# EAGLE design diagnostic-main (EAGLE 9.5.0)

## Sheet 1 of 3: MCU
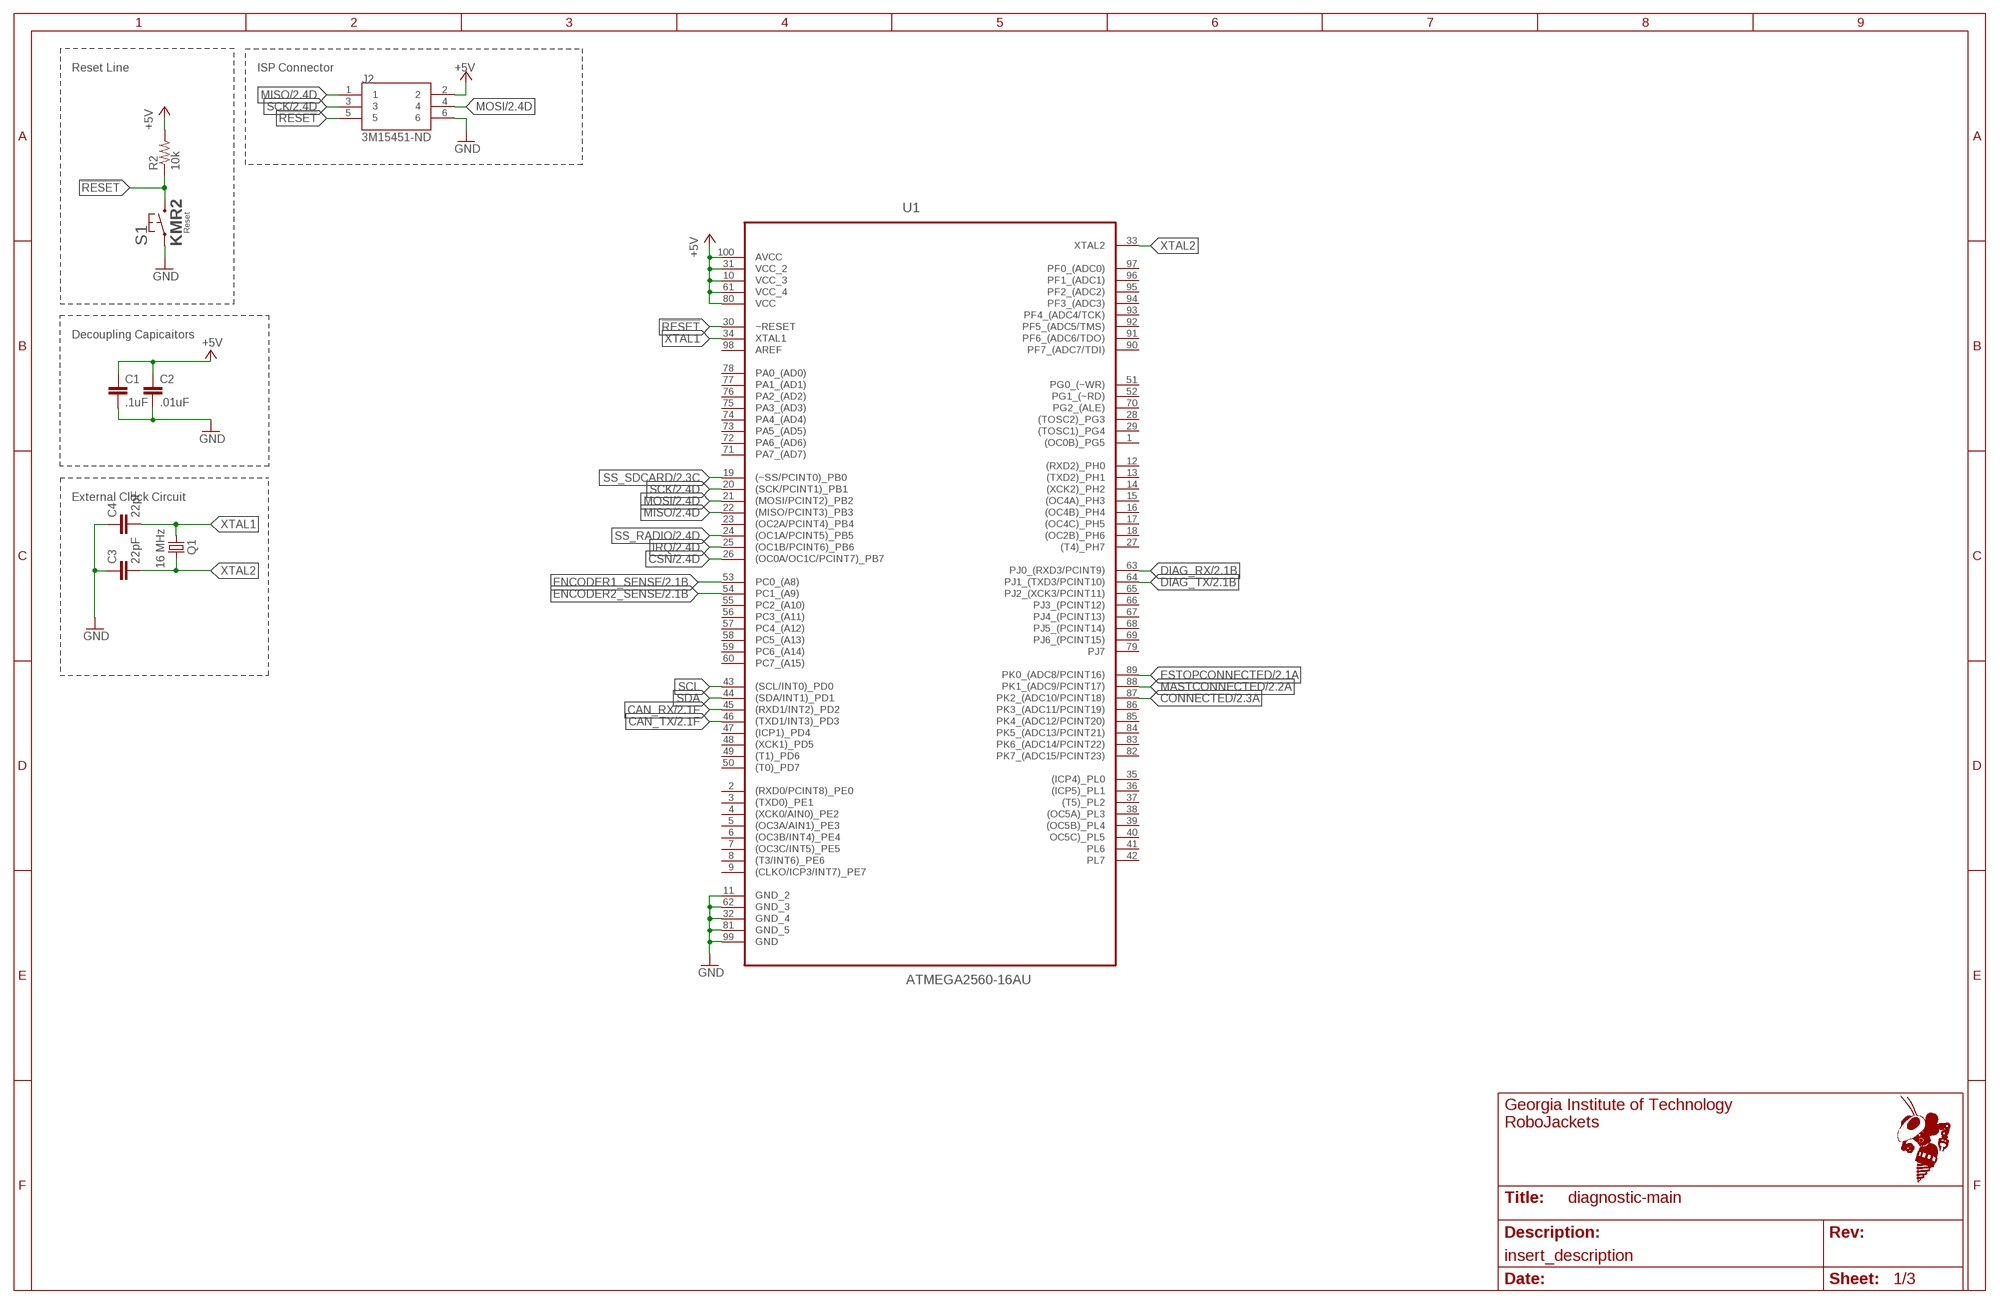
[diagram p0: schematic, sheet 1]
FRAME1 (FRAME_B_L): SCH_DESC: insert_description

### Parts
C1  .1uF  C-EUC0603  [C0603]
C2  .01uF  C-EUC0603  [C0603]
C3  22pF  C-EUC0603  [C0603]
C4  22pF  C-EUC0603  [C0603]
J2  3M15451-ND  30306-6002HB  [3M_30306-6002HB]
Q1  16 MHz  CSM-7X-DU  [CSM-7X-DU]
R2  10k  R-US_R0402  [R0402]
S1  KMR2  [KMR2]
U1  ATMEGA2560-16AU  [QFP50P1600X1600X120-100N]

### Nets
!RESET: J2.5 R2.1 S1.2.1 S1.2.2 U1.30(~RESET)
+5V: C1.1 C2.1 J2.2 R2.2 U1.10(VCC_3) U1.31(VCC_2) U1.61(VCC_4) U1.80(VCC) U1.100(AVCC) ; also sheet 2
CAN_RX: U1.45((RXD1/INT2)_PD2) ; also sheet 2
CAN_TX: U1.46((TXD1/INT3)_PD3) ; also sheet 2
CONNECTED: U1.87(PK2_(ADC10/PCINT18)) ; also sheet 2
CSN: U1.26((OC0A/OC1C/PCINT7)_PB7) ; also sheet 2
DIAG_RX: U1.63(PJ0_(RXD3/PCINT9)) ; also sheet 2
DIAG_TX: U1.64(PJ1_(TXD3/PCINT10)) ; also sheet 2
ENCODER1_SENSE: U1.53(PC0_(A8)) ; also sheet 2
ENCODER2_SENSE: U1.54(PC1_(A9)) ; also sheet 2
ESTOPCONNECTED: U1.89(PK0_(ADC8/PCINT16)) ; also sheet 2
GND: C1.2 C2.2 C3.1 C4.1 J2.6 S1.1.1 S1.1.2 U1.11(GND_2) U1.32(GND_4) U1.62(GND_3) U1.81(GND_5) U1.99(GND) ; also sheet 2
IRQ: U1.25((OC1B/PCINT6)_PB6) ; also sheet 2
MASTCONNECTED: U1.88(PK1_(ADC9/PCINT17)) ; also sheet 2
MISO: J2.1 U1.22((MISO/PCINT3)_PB3) ; also sheet 2
MOSI: J2.4 U1.21((MOSI/PCINT2)_PB2) ; also sheet 2
SCK: J2.3 U1.20((SCK/PCINT1)_PB1) ; also sheet 2
SCL: U1.43((SCL/INT0)_PD0)
SDA: U1.44((SDA/INT1)_PD1)
SS_RADIO: U1.24((OC1A/PCINT5)_PB5) ; also sheet 2
SS_SDCARD: U1.19((~SS/PCINT0)_PB0) ; also sheet 2
XTAL1: C4.2 Q1.1 U1.34(XTAL1)
XTAL2: C3.2 Q1.2 U1.33(XTAL2)
Unconnected: U1.1((OC0B)_PG5) U1.2((RXD0/PCINT8)_PE0) U1.3((TXD0)_PE1) U1.4((XCK0/AIN0)_PE2) U1.5((OC3A/AIN1)_PE3) U1.6((OC3B/INT4)_PE4) U1.7((OC3C/INT5)_PE5) U1.8((T3/INT6)_PE6) U1.9((CLKO/ICP3/INT7)_PE7) U1.12((RXD2)_PH0) U1.13((TXD2)_PH1) U1.14((XCK2)_PH2) U1.15((OC4A)_PH3) U1.16((OC4B)_PH4) U1.17((OC4C)_PH5) U1.18((OC2B)_PH6) U1.23((OC2A/PCINT4)_PB4) U1.27((T4)_PH7) U1.28((TOSC2)_PG3) U1.29((TOSC1)_PG4) U1.35((ICP4)_PL0) U1.36((ICP5)_PL1) U1.37((T5)_PL2) U1.38((OC5A)_PL3) U1.39((OC5B)_PL4) U1.40(OC5C)_PL5) U1.41(PL6) U1.42(PL7) U1.47((ICP1)_PD4) U1.48((XCK1)_PD5) U1.49((T1)_PD6) U1.50((T0)_PD7) U1.51(PG0_(~WR)) U1.52(PG1_(~RD)) U1.55(PC2_(A10)) U1.56(PC3_(A11)) U1.57(PC4_(A12)) U1.58(PC5_(A13)) U1.59(PC6_(A14)) U1.60(PC7_(A15)) U1.65(PJ2_(XCK3/PCINT11)) U1.66(PJ3_(PCINT12)) U1.67(PJ4_(PCINT13)) U1.68(PJ5_(PCINT14)) U1.69(PJ6_(PCINT15)) U1.70(PG2_(ALE)) U1.71(PA7_(AD7)) U1.72(PA6_(AD6)) U1.73(PA5_(AD5)) U1.74(PA4_(AD4)) U1.75(PA3_(AD3)) U1.76(PA2_(AD2)) U1.77(PA1_(AD1)) U1.78(PA0_(AD0)) U1.79(PJ7) U1.82(PK7_(ADC15/PCINT23)) U1.83(PK6_(ADC14/PCINT22)) U1.84(PK5_(ADC13/PCINT21)) U1.85(PK4_(ADC12/PCINT20)) U1.86(PK3_(ADC11/PCINT19)) U1.90(PF7_(ADC7/TDI)) U1.91(PF6_(ADC6/TDO)) U1.92(PF5_(ADC5/TMS)) U1.93(PF4_(ADC4/TCK)) U1.94(PF3_(ADC3)) U1.95(PF2_(ADC2)) U1.96(PF1_(ADC1)) U1.97(PF0_(ADC0)) U1.98(AREF)

### Notes on the sheet
- Reset Line | ISP Connector
- Decoupling Capicaitors
- External Clock Circuit

## Sheet 2 of 3: Connectors
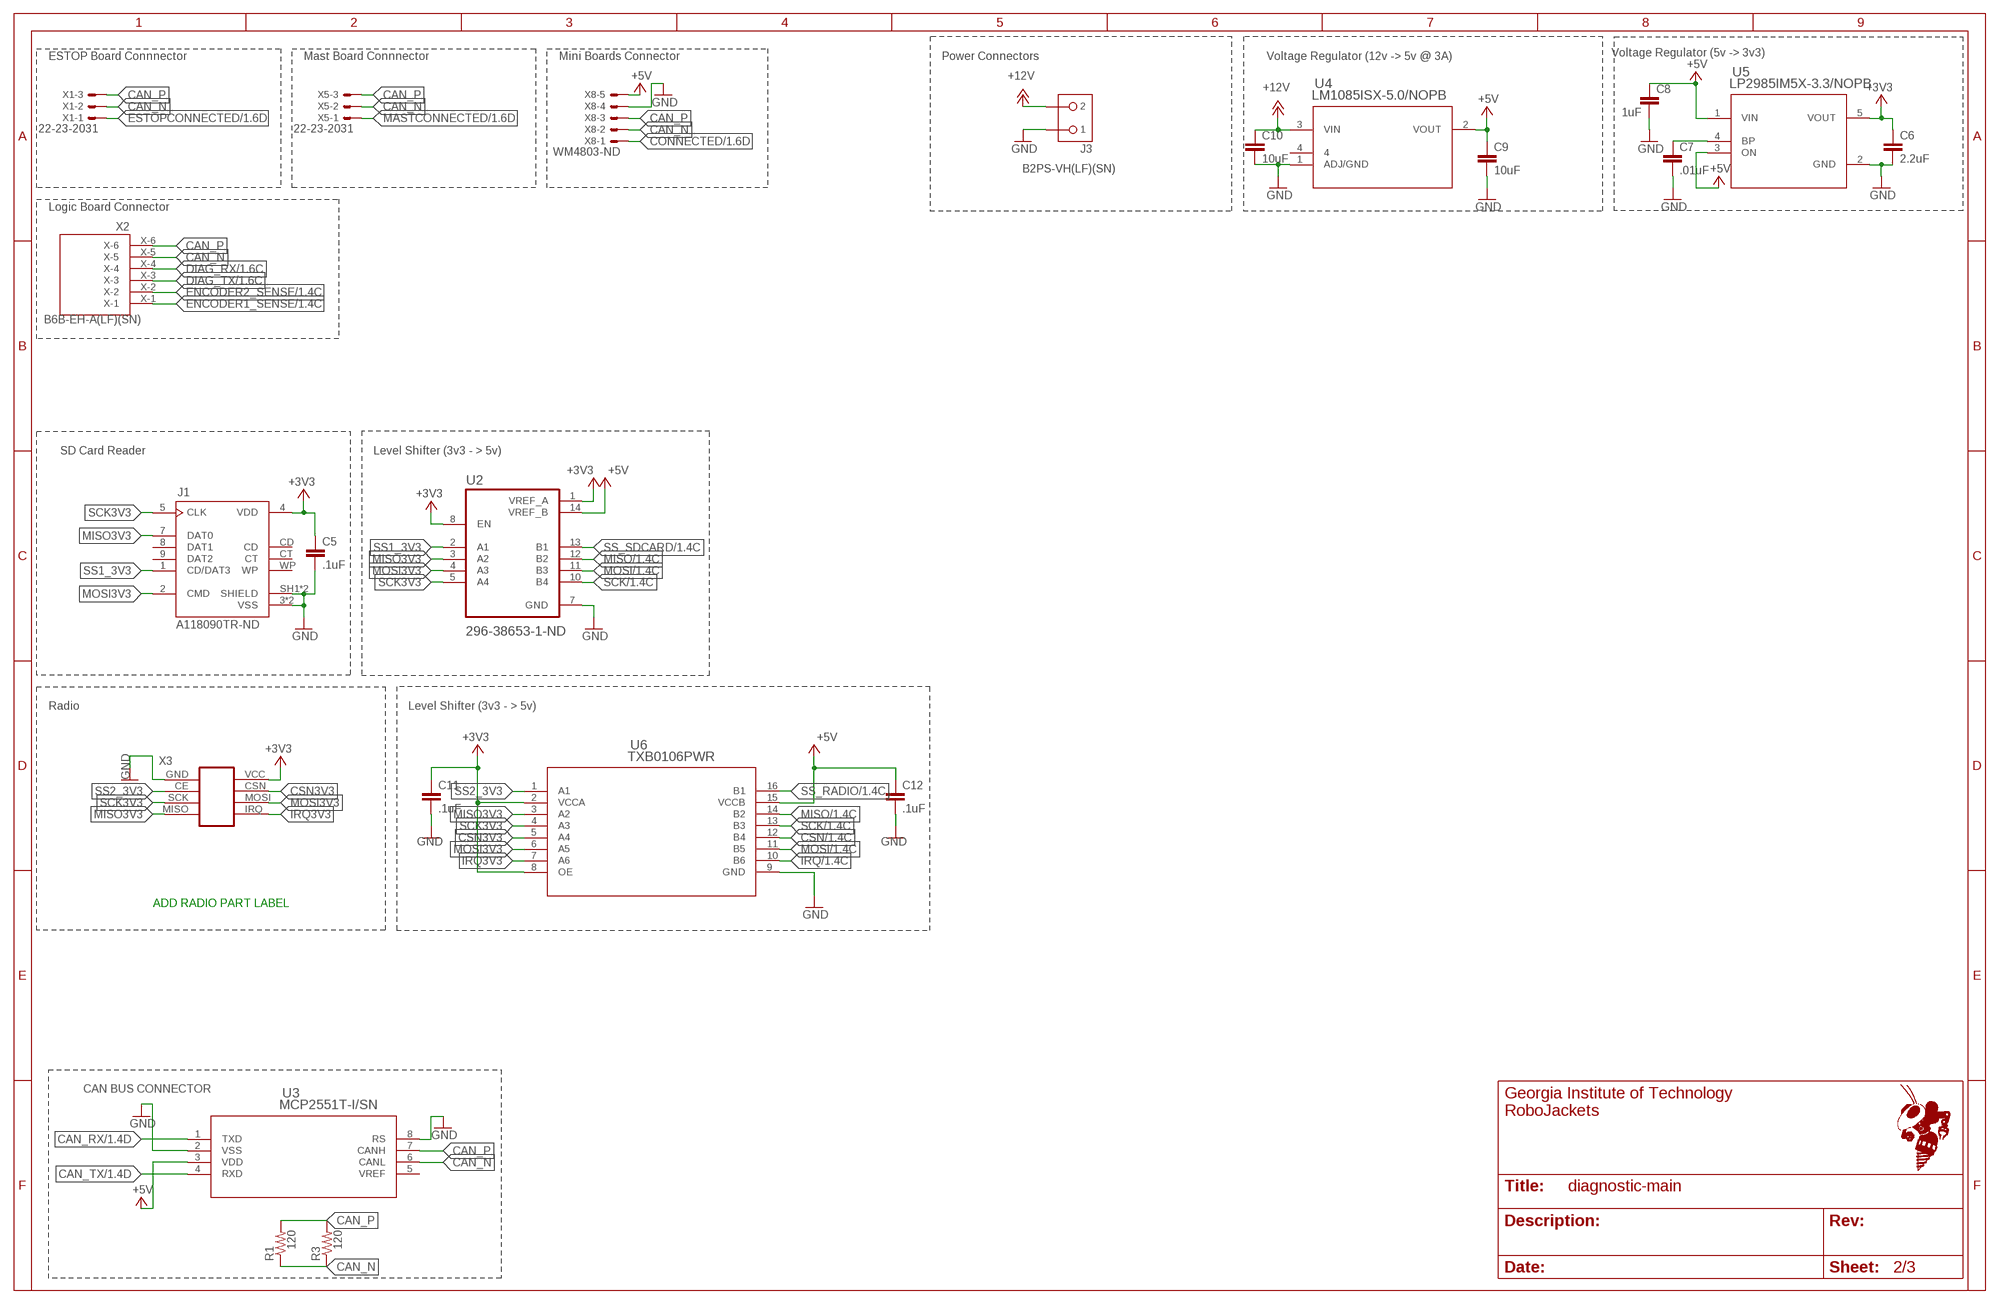
[diagram p1: schematic, sheet 2]
FRAME2 (FRAME_B_L): SCH_DESC: insert_description

### Parts
C5  .1uF  C-EUC0603  [C0603]
C6  2.2uF  C-EUC0603  [C0603]
C7  .01uF  C-EUC0603  [C0603]
C8  1uF  C-EUC0603  [C0603]
C9  10uF  C-EUC0805  [C0805]
C10  10uF  C-EUC0805  [C0805]
C11  .1uF  C-EUC0603  [C0603]
C12  .1uF  C-EUC0603  [C0603]
J1  A118090TR-ND  1939870-1  [TE_1939870-1]
J3  B2PS-VH(LF)(SN)  [B2PS-CENTERED]
R1  120  R-US_R0402  [R0402]
R3  120  R-US_R0402  [R0402]
U2  296-38653-1-ND  LSF0204PWR  [SOP65P640X120-14N]
U3  MCP2551T-I/SN  [SOIC8-N_MC]
U4  LM1085ISX-5.0/NOPB  [TS3B]
U5  LP2985IM5X-3.3/NOPB  [MF05A]
U6  TXB0106PWR  [PW16]
X1  22-23-2031  [22-23-2031]
X2  B6B-EH-A(LF)(SN)  [B6BEHALFSN]
X3  NRF24L01+PA+LNA  [NRF24L01+PA+LNA]
X5  22-23-2031  [22-23-2031]
X8  WM4803-ND  22-23-2051  [22-23-2051]

### Nets
+3V3: C5.1 C6.1 C11.1 J1.4(VDD) U2.1(VREF_A) U2.8(EN) U5.5(VOUT) U6.2(VCCA) U6.8(OE) X3.VCC
+5V: C8.1 C9.1 C12.1 U2.14(VREF_B) U3.3(VDD) U4.2(VOUT) U5.1(VIN) U5.3(ON) U6.15(VCCB) X8.5 ; also sheet 1
+12V: C10.1 J3.2 U4.3(VIN)
CAN_N: R1.1 R3.1 U3.6(CANL) X1.2 X2.X-5 X5.2 X8.2
CAN_P: R1.2 R3.2 U3.7(CANH) X1.3 X2.X-6 X5.3 X8.3
CAN_RX: U3.1(TXD) ; also sheet 1
CAN_TX: U3.4(RXD) ; also sheet 1
CONNECTED: X8.1 ; also sheet 1
CSN: U6.12(B4) ; also sheet 1
CSN3V3: U6.5(A4) X3.CSN
DIAG_RX: X2.X-4 ; also sheet 1
DIAG_TX: X2.X-3 ; also sheet 1
ENCODER1_SENSE: X2.X-1 ; also sheet 1
ENCODER2_SENSE: X2.X-2 ; also sheet 1
ESTOPCONNECTED: X1.1 ; also sheet 1
GND: C5.2 C6.2 C7.2 C8.2 C9.2 C10.2 C11.2 C12.2 J1.3(VSS) J1.6(VSS) J1.SH1(SHIELD) J1.SH2(SHIELD) J3.1 U2.7(GND) U3.2(VSS) U3.8(RS) U4.1(ADJ/GND) U5.2(GND) U6.9(GND) X3.GND X8.4 ; also sheet 1
IRQ: U6.10(B6) ; also sheet 1
IRQ3V3: U6.7(A6) X3.IRQ
MASTCONNECTED: X5.1 ; also sheet 1
MISO: U2.12(B2) U6.14(B2) ; also sheet 1
MISO3V3: J1.7(DAT0) U2.3(A2) U6.3(A2) X3.MISO
MOSI: U2.11(B3) U6.11(B5) ; also sheet 1
MOSI3V3: J1.2(CMD) U2.4(A3) U6.6(A5) X3.MOSI
N$1: C7.1 U5.4(BP)
SCK: U2.10(B4) U6.13(B3) ; also sheet 1
SCK3V3: J1.5(CLK) U2.5(A4) U6.4(A3) X3.SCK
SS1_3V3: J1.1(CD/DAT3) U2.2(A1)
SS2_3V3: U6.1(A1) X3.CE
SS_RADIO: U6.16(B1) ; also sheet 1
SS_SDCARD: U2.13(B1) ; also sheet 1
Unconnected: J1.8(DAT1) J1.9(DAT2) J1.CD J1.CT J1.WP U3.5(VREF) U4.4

### Notes on the sheet
- Voltage Regulator (5v -> 3v3)
- ESTOP Board Connnector | Mast Board Connnector | Mini Boards Connector | Power Connectors | Voltage Regulator (12v -> 5v @ 3A)
- Logic Board Connector
- SD Card Reader | Level Shifter (3v3 - > 5v)
- Radio | Level Shifter (3v3 - > 5v)
- ADD RADIO PART LABEL
- CAN BUS CONNECTOR

## Sheet 3 of 3

## Library data of the parts
C1-C12 = rcl:C-EU: CAPACITOR, European symbol; SPICEPREFIX: C
J1 = A118090TR-ND:1939870-1: SD CARD CONNECTOR EMBOSS ASSY; CENTERLINE_PITCH: 1.7 mm[.06 in]; COMMENT: 1939870-1; DESCRIPTION: Conn SD Card PIN 9 POS 1.7mm Solder RA SMD 0.5A/Contact T/R; DIGI-KEY_PART_NUMBER: A118090CT-ND; DIGI-KEY_PURCHASE_URL: https://www.digikey.com/product-detail/en/te-connectivity-amp-connectors/1939870-1/A118090CT-ND/4729818?utm_source=snapeda&utm_medium=aggregator&utm_campaign=symbol; MF: TE Connectivity; MP: 1939870-1; NUMBER_OF_POSITIONS: 9; PACKAGE: None; PRODUCT_TYPE: Removable Memory Products; TE_PURCHASE_URL: https://www.te.com/usa-en/product-1939870-1.html?te_bu=Cor&te_type=disp&te_campaign=seda_glo_cor-seda-global-disp-prtnr-fy19-seda-model-bom-cta_sma-317_1&elqCampaignId=32493
J2 = 3M15451-ND:30306-6002HB: Conn Shrouded Header HDR 6 POS 2.54mm Solder ST Thru-Hole; DESCRIPTION: Conn Shrouded Header HDR 6 POS 2.54mm Solder ST Thru-Hole; DIGI-KEY_PART_NUMBER: 3M15451-ND; DIGI-KEY_PURCHASE_URL: https://www.digikey.com/product-detail/en/3m/30306-6002HB/3M15451-ND/1237391?utm_source=snapeda&utm_medium=aggregator&utm_campaign=symbol; MF: 3M; MP: 30306-6002HB; PACKAGE: None
J3 = RoboJackets-Connectors:B2P?-VH(LF)(SN): Power Connector Brand: JST Sales America Inc. <https://www.jst.com/> Series: VH <http://www.digikey.com/product-search/en?FV=fff40016,fff802f3,ffec0e9d> Distributor: Digi-Key <http://www.digikey.com/product-detail/en/B2PS-VH%28LF%29%28SN%29/455-1648-ND/926555>; DIGIKEY: 455-1648-ND; MPN: B2PS-VH(LF)(SN)
Q1 = crystal:CSM-7X-DU: SMD CRYSTAL Source: www.ecsxtal.com .. Crystal 3.6864MHz CSM_7X_DU.PDF; OC_FARNELL: unknown; OC_NEWARK: unknown
R1-R3 = rcl:R-US_: RESISTOR, American symbol; SPICEPREFIX: R
S1 = RoboJackets-Switches:KMR2; FUNCTION: Reset
U1 = ATMEGA2560-16AU:ATMEGA2560-16AU: Microcontroller; AVAILABILITY: Unavailable; DESCRIPTION: Embedded microcontroller ATMEGA2560-16AU TQFP 100 _14x14_ Microchip Technology 8-Bit 16 MHz I/O number 86; MF: Microchip; MP: ATMEGA2560-16AU; PACKAGE: TQFP-100 Microchip; PRICE: None
U2 = 296-38653-1-ND:LSF0204PWR: 4-Bit Bidirectional Multi-Voltage Level Translator for Open-Drain & Push- Pull 14-TSSOP -40 to 125; DESCRIPTION: 4-Bit Bidirectional Multi-Voltage Level Translator for Open-Drain & Push- Pull 14-TSSOP -40 to 125; DIGI-KEY_PART_NUMBER: 296-38653-1-ND; DIGI-KEY_PURCHASE_URL: https://www.digikey.com/product-detail/en/texas-instruments/LSF0204PWR/296-38653-1-ND/5056916?utm_source=snapeda&utm_medium=aggregator&utm_campaign=symbol; MF: Texas Instruments; MP: LSF0204PWR; PACKAGE: TSSOP-14 Texas Instruments
U3 = MCP2551T:MCP2551T-I/SN; MANUFACTURER_PART_NUMBER: MCP2551TISN; VENDOR: Microchip
U4 = LM1085ISX:LM1085ISX-5.0/NOPB; MANUFACTURER_PART_NUMBER: LM1085ISX5.0NOPB; VENDOR: Texas Instruments
U5 = LP2985IM5X:LP2985IM5X-3.3/NOPB; MANUFACTURER_PART_NUMBER: LP2985IM5X3.3NOPB; VENDOR: Texas Instruments
U6 = TXB0106PWR:TXB0106PWR; MANUFACTURER_PART_NUMBER: TXB0106PWR; VENDOR: Texas Instruments
X1 X5 = con-molex:22-23-2031: .100" (2.54mm) Center Header - 3 Pin; MF: MOLEX; MPN: 22-23-2031; OC_FARNELL: 1462950; OC_NEWARK: 30C0862
X2 = IGVC-Connector:B6B-EH-A(LF)(SN)
X3 = IGVC-Connector:NRF24L01+PA+LNA: NRF24L01+PA+LNA
X8 = con-molex:22-23-2051: .100" (2.54mm) Center Header - 5 Pin; MF: MOLEX; MPN: 22-23-2051; OC_FARNELL: 1462952; OC_NEWARK: 38C9178

## Board
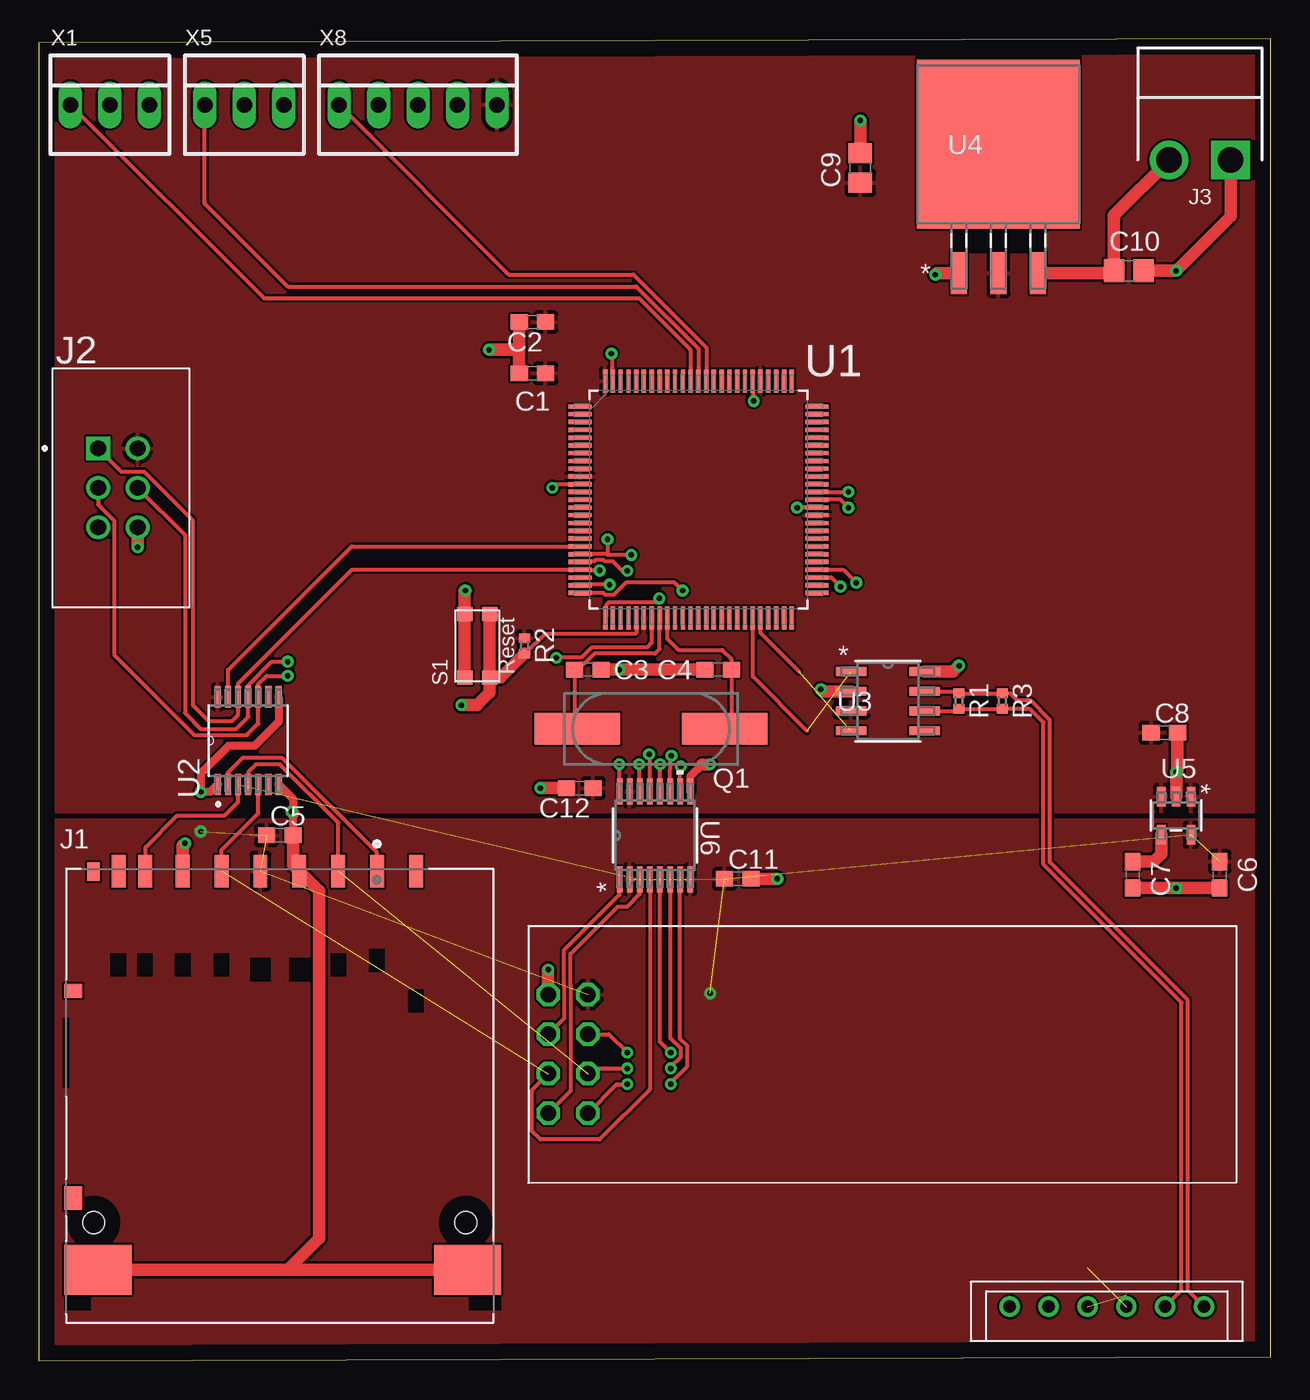
[diagram p2: board, top side]
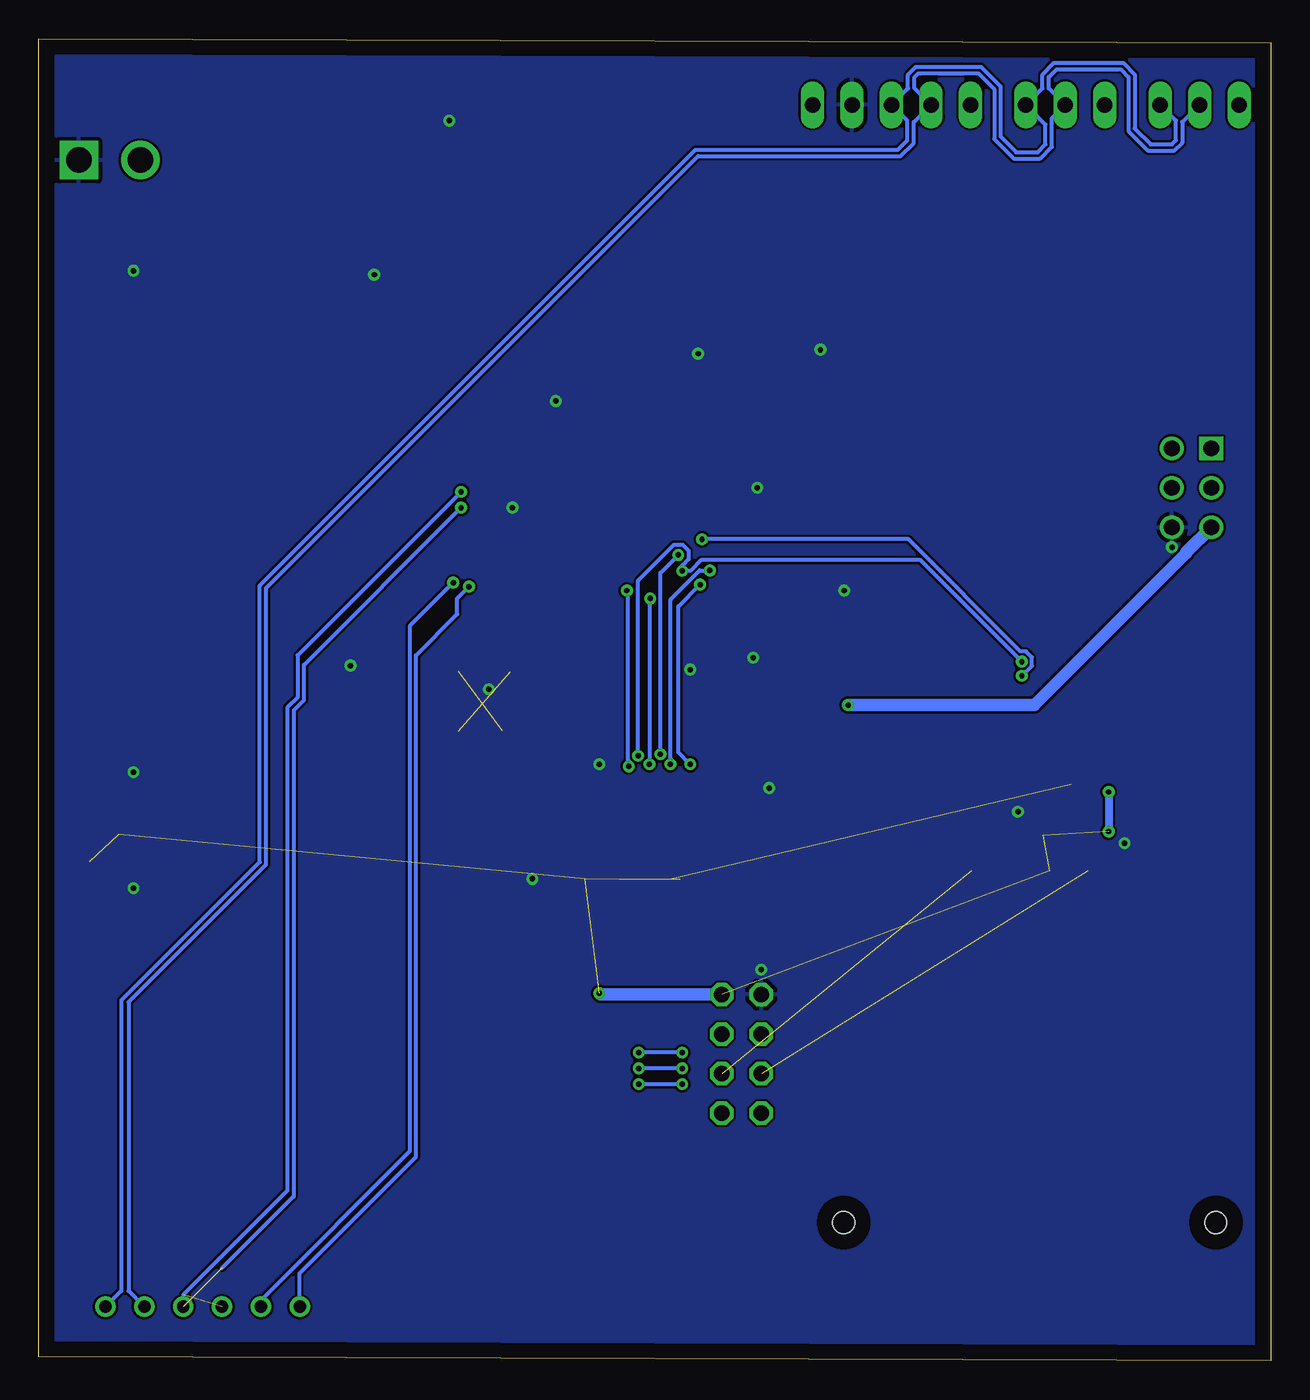
[diagram p3: board, bottom side, seen from below]

Size 79.23 x 85.01 mm. Coordinates in mm from the lower left corner, seen from the top.
Outline: 0,0 79.23,0.25 79.23,85.01 0,84.76 0,0
Copper layers (1*16): Top 0.035mm / dielectric 1.5mm / Bottom 0.035mm
Design rules "default": minimum track width 6mil, minimum drill 0.35mm, track to track 6mil, track to pad 6mil, pad to pad 6mil, via to via 6mil, smd to smd 6mil, copper to edge 40mil, drill to drill 6mil, minimum pad ring 10mil, minimum via ring 8mil, stop-mask expansion 4mil, vias tented up to drill 0mil, thermal gap 10mil

### Footprints (pad centres in the part's own frame; a part is rotated, then mirrored left to right if it is on the bottom)
C0603 = smd 1.1 x 1: 1 -0.85,0; 2 0.85,0
C0805 = smd 1.3 x 1.5: 1 -0.95,0; 2 0.95,0
TE_1939870-1 = smd 0.9 x 2.1: 1 6.255,22.6; 2 3.755,22.6; 3 1.255,22.6; 4 -1.245,22.6; 5 -3.745,22.6; 6 -6.245,22.6; 7 -8.67,22.6; 8 -10.37,22.6; 9 8.755,22.6 | smd 0.8 x 1.2: CD -11.97,22.55 | smd 1.13 x 0.9: CT -13.285,14.88 | smd 4.32 x 3.2: SH1 -11.69,-3.05; SH2 12.09,-3.05 | smd 1.13 x 1.5: WP -13.285,1.57 | hole 1.4: -11.97,0; 11.97,0
3M_30306-6002HB = drill 1.02 pad 1.52 square: 1 0,0 | drill 1.02 pad 1.52: 2 2.54,0; 3 0,-2.54; 4 2.54,-2.54; 5 0,-5.08; 6 2.54,-5.08
B2PS-CENTERED = drill 1.65 square: 1 -1.98,0 | drill 1.65: 2 1.98,0
CSM-7X-DU = smd 5.5 x 2: 1 -4.75,0; 2 4.75,0
R0402 = smd 0.6 x 0.7: 1 -0.5,0; 2 0.5,0
KMR2 = smd 0.9 x 1: 1.1 -2.05,0.8; 1.2 2.05,0.8; 2.1 -2.05,-0.8; 2.2 2.05,-0.8
QFP50P1600X1600X120-100N = smd 1.473 x 0.279: 1 -7.62,5.994; 2 -7.62,5.512; 3 -7.62,5.004; 4 -7.62,4.496; 5 -7.62,3.988; 6 -7.62,3.505; 7 -7.62,2.997; 8 -7.62,2.489; 9 -7.62,2.007; 10 -7.62,1.499; 11 -7.62,0.991; 12 -7.62,0.508; 13 -7.62,0; 14 -7.62,-0.508; 15 -7.62,-0.991; 16 -7.62,-1.499; 17 -7.62,-2.007; 18 -7.62,-2.489; 19 -7.62,-2.997; 20 -7.62,-3.505; 21 -7.62,-3.988; 22 -7.62,-4.496; 23 -7.62,-5.004; 24 -7.62,-5.512; 25 -7.62,-5.994; 51 7.62,-5.994; 52 7.62,-5.512; 53 7.62,-5.004; 54 7.62,-4.496; 55 7.62,-3.988; 56 7.62,-3.505; 57 7.62,-2.997; 58 7.62,-2.489; 59 7.62,-2.007; 60 7.62,-1.499; 61 7.62,-0.991; 62 7.62,-0.508; 63 7.62,0; 64 7.62,0.508; 65 7.62,0.991; 66 7.62,1.499; 67 7.62,2.007; 68 7.62,2.489; 69 7.62,2.997; 70 7.62,3.505; 71 7.62,3.988; 72 7.62,4.496; 73 7.62,5.004; 74 7.62,5.512; 75 7.62,5.994 | smd 0.279 x 1.473: 26 -5.994,-7.62; 27 -5.512,-7.62; 28 -5.004,-7.62; 29 -4.496,-7.62; 30 -3.988,-7.62; 31 -3.505,-7.62; 32 -2.997,-7.62; 33 -2.489,-7.62; 34 -2.007,-7.62; 35 -1.499,-7.62; 36 -0.991,-7.62; 37 -0.508,-7.62; 38 0,-7.62; 39 0.508,-7.62; 40 0.991,-7.62; 41 1.499,-7.62; 42 2.007,-7.62; 43 2.489,-7.62; 44 2.997,-7.62; 45 3.505,-7.62; 46 3.988,-7.62; 47 4.496,-7.62; 48 5.004,-7.62; 49 5.512,-7.62; 50 5.994,-7.62; 76 5.994,7.62; 77 5.512,7.62; 78 5.004,7.62; 79 4.496,7.62; 80 3.988,7.62; 81 3.505,7.62; 82 2.997,7.62; 83 2.489,7.62; 84 2.007,7.62; 85 1.499,7.62; 86 0.991,7.62; 87 0.508,7.62; 88 0,7.62; 89 -0.508,7.62; 90 -0.991,7.62; 91 -1.499,7.62; 92 -2.007,7.62; 93 -2.489,7.62; 94 -2.997,7.62; 95 -3.505,7.62; 96 -3.988,7.62; 97 -4.496,7.62; 98 -5.004,7.62; 99 -5.512,7.62; 100 -5.994,7.62
SOP65P640X120-14N = smd 1.37 x 0.39: 1 -2.82,1.95; 2 -2.82,1.3; 3 -2.82,0.65; 4 -2.82,0; 5 -2.82,-0.65; 6 -2.82,-1.3; 7 -2.82,-1.95; 8 2.82,-1.95; 9 2.82,-1.3; 10 2.82,-0.65; 11 2.82,0; 12 2.82,0.65; 13 2.82,1.3; 14 2.82,1.95
SOIC8-N_MC = smd 1.981 x 0.559: 1 -2.362,1.905; 2 -2.362,0.635; 3 -2.362,-0.635; 4 -2.362,-1.905; 5 2.362,-1.905; 6 2.362,-0.635; 7 2.362,0.635; 8 2.362,1.905
TS3B = smd 1.016 x 2.692: 1 -2.54,-8.28; 2 0,-8.28; 3 2.54,-8.28 | smd 10.465 x 10.871: 4 0,0
MF05A = smd 1.27 x 0.559: 1 -1.219,0.953; 2 -1.219,0; 3 -1.219,-0.953; 4 1.219,-0.953; 5 1.219,0.953
PW16 = smd 1.676 x 0.356: 1 -2.819,2.275; 2 -2.819,1.625; 3 -2.819,0.975; 4 -2.819,0.325; 5 -2.819,-0.325; 6 -2.819,-0.975; 7 -2.819,-1.625; 8 -2.819,-2.275; 9 2.819,-2.275; 10 2.819,-1.625; 11 2.819,-0.975; 12 2.819,-0.325; 13 2.819,0.325; 14 2.819,0.975; 15 2.819,1.625; 16 2.819,2.275
22-23-2031 = drill 1 long: 1 -2.54,0; 2 0,0; 3 2.54,0
B6BEHALFSN = drill 0.8: X-1 2.5,2.2; X-2 5,2.2; X-3 7.5,2.2; X-4 10,2.2; X-5 12.5,2.2; X-6 15,2.2
NRF24L01+PA+LNA = drill 1.016 octagon: CE 21.59,-0.68; CSN 19.05,-0.68; GND 21.59,-3.22; IRQ 19.05,4.4; MISO 21.59,4.4; MOSI 19.05,1.86; SCK 21.59,1.86; VCC 19.05,-3.22
22-23-2051 = drill 1 long: 1 -5.08,0; 2 -2.54,0; 3 0,0; 4 2.54,0; 5 5.08,0

### Placement (x,y rotation side)
C1  31.75,63.5 180 top
C2  31.75,66.8 180 top
C3  35.31,44.45 180 top
C4  43.69,44.45 0 top
C5  15.49,33.78 0 top
C6  75.95,31.24 270 top
C7  70.36,31.24 270 top
C8  72.39,40.39 0 top
C9  52.83,76.71 90 top
C10  70.1,70.1 0 top
C11  44.96,30.99 0 top
C12  34.8,36.83 180 top
J1  15.49,8.89 0 top
J2  3.81,58.67 0 top
J3  74.68,77.22 180 top
Q1  39.37,40.64 180 top
R1  59.18,42.42 90 top
R2  31.24,45.97 90 top
R3  61.98,42.42 90 top
S1  28.19,45.97 90 top
U1  42.42,55.37 0 top
U2  13.46,39.88 90 top
U3  54.61,42.42 0 top
U4  61.72,78.23 0 top
U5  73.15,35.05 270 top
U6  39.62,33.78 90 top
X1  4.57,80.77 0 top
X2  59.94,1.27 0 top
X3  54.36,20.32 180 top
X5  13.21,80.77 0 top
X8  24.38,80.77 0 top

### Tracks (layer width: path | path; a pad name or v marks a point on that pad's centre or on a via)
!RESET  (via drill 0.35)
  Top 0.254: 28.99,48.01 S1.2.2 | U1.30 38.43,46.81 38.35,46.74 32.55,46.74 31.29,45.47 R2.1
  Top 0.813: S1.2.1 28.99,48.01 | S1.2.1 29.69,43.92 R2.1 | S1.2.1 28.99,42.96 28.19,42.16 v27.18,42.16
  Bottom 0.813: J2.5 5.41,51.99 5.41,51.94 15.19,42.16 v27.18,42.16
+3V3  (via drill 0.35)  (8 unrouted)
  Top 0.508: U2.1 11.03,36.58 v10.41,36.58 10.41,37.77 12.19,39.55 13.89,39.55 15.41,41.07 U2.8
  Bottom 0.508: v10.41,36.58 v10.41,34.04
  Bottom 0.813: X3.VCC 43.1,23.54 v43.18,23.62
  pour Top: -1.27,34.8 -1.27,-1.27 81.53,-1.27 81.53,34.8
+5V
  pour Top: -1.02,86.36 81.28,86.36 81.28,35.31 -1.02,35.31
+12V
  Top 0.813: J3.2 69.15,73.67 C10.1 69,69.95 U4.3
CAN_N
  Top 0.254: X2.X-5 73.49,4.52 73.49,23.03 64.62,31.9 64.62,41.05 63.75,41.91 63.45,41.91 63.45,41.92 62.58,41.92 R3.1 R1.1 59.05,41.78 U3.6
  Bottom 0.254: X2.X-5 73.46,4.49 73.46,23.06 64.62,31.9 64.62,49.68 36.83,77.47 23.81,77.47 22.96,78.32 22.96,79.65 X8.2 22.91,81.84 22.91,82.55 22.66,82.8 18.8,82.8 17.78,81.79 17.78,78.57 16.53,77.32 14.82,77.32 14.07,78.06 14.07,79.91 X5.2 14.28,81.84 14.28,82.55 13.77,83.06 9.65,83.06 9.14,82.55 9.14,79.08 7.89,77.83 6.18,77.83 5.69,78.32 5.69,79.65 X1.2
CAN_P
  Top 0.254: X2.X-6 73.9,4.52 73.9,23.2 65.02,32.07 65.02,41.21 63.79,42.45 62.95,42.45 62.47,42.92 R3.2 R1.2 59.05,43.05 U3.7
  Bottom 0.254: X2.X-6 73.93,4.49 73.93,23.17 65.02,32.07 65.02,49.85 37,77.88 23.98,77.88 23.37,78.49 23.37,79.76 X8.3 23.32,81.84 23.32,82.72 22.82,83.21 18.63,83.21 17.37,81.96 17.37,78.74 16.36,77.72 14.99,77.72 14.48,78.23 14.48,79.5 X5.3 14.68,81.84 14.68,82.72 13.94,83.46 9.48,83.46 8.74,82.72 8.74,79.25 7.72,78.23 6.35,78.23 6.1,78.49 6.1,79.76 X1.3
CAN_RX  (1 unrouted)
  Top 0.254: U1.45 45.92,43.99 49.4,40.51
CAN_TX  (1 unrouted)
  Top 0.254: U1.46 46.41,46.81 48.9,44.32
CONNECTED
  Top 0.254: X8.1 30.23,69.85 38.23,69.85 42.93,65.16 U1.87
CSN  (via drill 0.35)
  Top 0.254: U6.12 39.95,38.35 v39.96,38.35 | v39.91,49.02 39.65,48.77 36.65,48.77 36.49,48.6 36.49,47.82 U1.26
  Bottom 0.254: v39.96,38.35 39.91,38.4 v39.91,49.02
CSN3V3  (via drill 0.35)
  Top 0.254: X3.CSN 36.66,21 v37.85,19.81 | v40.64,19.81 39.95,20.5 U6.5
  Bottom 0.254: v37.85,19.81 v40.64,19.81
DIAG_RX  (via drill 0.35)  (1 unrouted)
  Top 0.254: v52.07,54.86 51.56,55.37 U1.63
  Bottom 0.254: v52.07,54.86 62.18,44.75 62.18,42.48 62.84,41.83 62.84,10.57 67.44,5.96
DIAG_TX  (via drill 0.35)  (1 unrouted)
  Top 0.254: U1.64 v52.07,55.88
  Bottom 0.254: v52.07,55.88 62.59,45.36 62.59,42.65 63.25,42 63.25,10.92 69.94,4.22
ENCODER1_SENSE  (via drill 0.35)
  Top 0.254: U1.53 50.98,50.37 v51.56,49.78
  Bottom 0.254: v51.56,49.78 52.32,49.02 52.32,48.01 54.97,45.36 54.97,13.11 62.48,5.59 62.48,3.51 X2.X-1
ENCODER2_SENSE  (via drill 0.35)
  Top 0.254: U1.54 51.74,50.88 v52.58,50.04
  Bottom 0.254: v52.58,50.04 55.37,47.24 55.37,13.46 64.94,3.89 X2.X-2
ESTOPCONNECTED
  Top 0.254: X1.1 14.48,68.33 38.61,68.33 41.91,65.02 U1.89
GND  (via drill 0.35)
  Top 0.254: U1.99 36.91,64.69 v36.83,64.77 | U1.11 33.25,56.36 v33.02,56.13 | U1.32 39.42,46.18 39.12,45.87 35.56,45.87 34.91,45.23 33.29,45.23 v33.27,45.21 | U1.62 v48.77,54.86 | U1.81 45.92,61.77 v45.97,61.72
  Top 0.508: C5.2 16.34,35.22 16.34,36.13 U2.7 | U6.9 41.91,36.61 41.91,37.59 42.67,38.35
  Top 0.762: 42.67,38.35 v43.18,38.35
  Top 0.813: C2.2 30.9,65.02 | 30.9,65.02 C1.2 | 30.9,65.02 v28.96,65.02 | C10.2 v73.15,70.1 76.66,73.61 J3.1 | S1.1.1 S1.1.2 27.39,49.49 v27.43,49.53 | C5.2 16.34,31.89 J1.3 18.03,30.2 18.03,7.87 16,5.84 | 16.34,35.22 v16.26,35.31 | J1.SH1 16,5.84 | 16,5.84 J1.SH2 | X3.GND v32.77,25.15 | C12.2 v32.26,36.83 | C11.2 v47.5,30.99 | U3.2 50.42,43.05 v50.29,43.18 | J2.6 v6.35,52.32 | J1.6 9.25,33.12 v9.4,33.27 | U5.2 v73.15,37.85 73.24,37.93 C8.2 | C9.2 v52.83,79.76 | U4.1 57.76,69.95 v57.66,69.85 | U3.8 58.8,44.32 v59.18,44.7 | C7.2 v73.15,30.39 C6.2 | C3.1 v37.34,44.45 C4.1
  pour Bottom: -1.27,86.36 81.53,86.36 81.53,-1.27 -1.27,-1.27
IRQ  (via drill 0.35)
  Top 0.254: U6.10 41.25,38.19 v41.28,38.22 | v41.4,49.53 40.89,50.04 37.76,50.04 36.98,49.25 36.43,49.25 36.31,49.38 U1.25
  Bottom 0.254: v41.28,38.22 41.28,38.57 41.34,38.64 41.34,49.47 v41.4,49.53
IRQ3V3  (via drill 0.35)
  Top 0.254: X3.IRQ 37.17,17.78 v37.85,17.78 | v40.64,17.78 40.64,17.87 41.7,18.93 41.7,20.25 41.25,20.71 U6.7
  Bottom 0.254: v37.85,17.78 v40.64,17.78
MASTCONNECTED
  Top 0.254: X5.1 10.67,74.42 16,69.09 38.42,69.09 42.42,65.09 U1.88
MISO  (via drill 0.35)
  Top 0.254: J2.1 5.31,57.18 6.78,57.18 9.91,54.05 9.91,42.16 10.92,41.15 12.45,41.15 12.81,41.51 U2.12 12.81,43.55 20.14,50.88 U1.22 34.85,50.82 v36.07,50.82 | U6.14 38.65,38.31 v38.61,38.35
  Bottom 0.254: v38.61,38.35 38.61,38.71 38.59,38.72 38.59,48.95 36.72,50.82 v36.07,50.82
MISO3V3  (1 unrouted)
  Top 0.254: J1.7 6.86,31.52 6.86,33.02 8.89,35.05 11.94,35.05 12.81,35.93 U2.3 | X3.MISO 34.21,17.37 34.21,24.14 34.19,24.16 34.19,26.16 37.24,29.21 37.85,29.21 38.65,30.01 U6.3
MOSI  (via drill 0.35)
  Top 0.254: v16,44.96 14.99,44.96 13.46,43.43 U2.11 13.46,41.4 12.7,40.64 10.41,40.64 9.4,41.66 9.4,53.09 J2.4 | U6.11 40.6,38.07 40.61,38.08 40.61,38.84 v40.69,38.91 | v37.85,50.8 37.53,50.8 36.92,51.4 36.42,51.4 36.34,51.48 35.8,51.48 35.72,51.4 34.82,51.4 U1.21
  Bottom 0.254: v40.69,38.91 40.69,50.16 38.37,52.47 37.83,52.47 37.44,52.09 37.44,51.54 37.85,51.14 v37.85,50.8 37.32,50.8 36.64,51.48 22.52,51.48 v16,44.96
MOSI3V3  (via drill 0.35)  (1 unrouted)
  Top 0.254: J1.2 19.25,34.6 15.49,38.35 13.97,38.35 13.46,37.85 U2.4 | X3.MOSI 35.64,18.8 v37.85,18.8 | U6.6 40.64,30.92 40.64,20.74 41.3,20.08 41.3,19.54 40.64,18.88 v40.64,18.8
  Bottom 0.254: v37.85,18.8 v40.64,18.8
N$1
  Top 0.813: C7.1 71.72,32.09 72.2,32.58 U5.4
SCK  (via drill 0.35)
  Top 0.254: v16,44.05 14.65,44.05 14.11,43.51 U2.10 14.11,40.97 13.38,40.23 9.99,40.23 4.85,45.37 4.85,54.03 3.81,55.07 J2.3 | U6.13 39.3,38.95 v39.25,39 | v38.1,51.82 36.58,51.82 | 36.58,51.82 36.51,51.88 35.63,51.88 35.61,51.87 U1.20 | v36.58,52.83 36.58,51.82
  Bottom 0.254: v39.25,39 39.25,50.66 v38.1,51.82 | v16,44.05 15.75,44.3 15.73,44.3 15.34,44.69 15.34,45.23 15.73,45.62 16.09,45.62 23.3,52.83 v36.58,52.83
SCK3V3  (1 unrouted)
  Top 0.254: J1.5 11.75,32.83 14.11,35.19 U2.5 | U6.4 39.3,17.45 36.07,14.22 32.26,14.22 31.73,14.76 31.73,17.42 X3.SCK
SS1_3V3
  Top 0.254: J1.1 21.75,32.67 15.66,38.76 13.11,38.76 12.16,37.82 U2.2
SS2_3V3
  Top 0.254: X3.CE 33.81,22.04 33.81,23.97 33.78,24 33.78,26.42 37.35,29.98 U6.1
SS_RADIO  (via drill 0.35)
  Top 0.254: U6.16 v37.35,38.34 v37.34,38.35 | v36.7,49.91 34.85,49.91 U1.24
  Bottom 0.254: v37.34,38.35 38.1,39.12 38.1,48.51 v36.7,49.91
SS_SDCARD
  Top 0.254: U2.13 12.16,44.42 20.12,52.37 U1.19
XTAL1
  Top 0.254: U1.34 40.41,46.46 41.15,45.72 43.94,45.72 44.54,45.12 C4.2 44.54,41.06 Q1.1
XTAL2
  Top 0.254: U1.33 39.93,45.77 39.62,45.47 35.73,45.47 35.08,44.82 34.83,44.82 C3.2 34.46,40.8 Q1.2